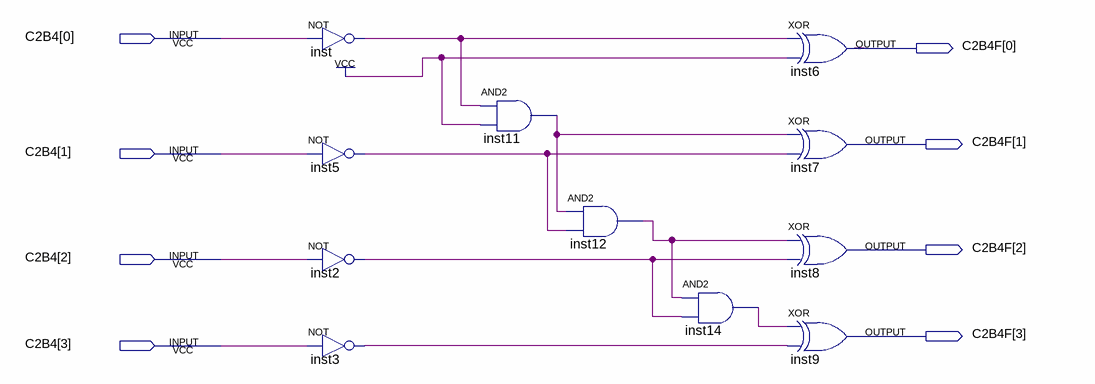
[diagram p0: schematic sheet]
// Quartus schematic QuatroBitsComplemento2.bdf as structural Verilog: 11 symbols, 8 pins
module QuatroBitsComplemento2 (
  input  [3:0] C2B4,
  output [3:0] C2B4F
);

  wire inst2_out, inst3_out, inst5_out, inst11_out, inst12_out, inst14_out, inst_out;

  not inst (inst_out, C2B4[0]);
  not inst5 (inst5_out, C2B4[1]);
  not inst2 (inst2_out, C2B4[2]);
  not inst3 (inst3_out, C2B4[3]);
  and inst11 (inst11_out, inst_out, 1'b1);
  and inst12 (inst12_out, inst11_out, inst5_out);
  and inst14 (inst14_out, inst12_out, inst2_out);
  xor inst6 (C2B4F[0], inst_out, 1'b1);
  xor inst7 (C2B4F[1], inst11_out, inst5_out);
  xor inst8 (C2B4F[2], inst12_out, inst2_out);
  xor inst9 (C2B4F[3], inst14_out, inst3_out);
endmodule
